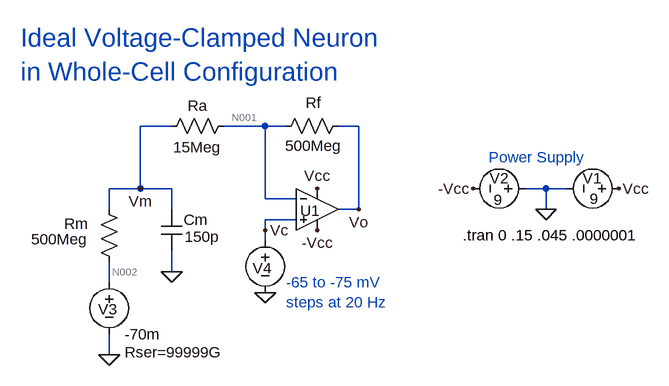
[diagram p0: schematic memtest.asc]
memtest.asc, the LTspice schematic file:
Version 4
SHEET 1 1492 812
WIRE 224 80 176 80
WIRE 368 80 304 80
WIRE 400 80 368 80
WIRE 512 80 480 80
WIRE 176 176 176 80
WIRE 176 176 128 176
WIRE 224 176 176 176
WIRE 800 176 768 176
WIRE 832 176 800 176
WIRE 368 192 368 80
WIRE 416 192 368 192
WIRE 128 208 128 176
WIRE 224 208 224 176
WIRE 512 208 512 80
WIRE 512 208 480 208
WIRE 800 208 800 176
WIRE 416 224 368 224
WIRE 368 240 368 224
WIRE 368 256 368 240
WIRE 224 304 224 272
WIRE 128 320 128 288
WIRE 128 432 128 400
FLAG 912 176 Vcc
FLAG 448 176 Vcc
FLAG 448 240 -Vcc
FLAG 688 176 -Vcc
FLAG 368 336 0
FLAG 224 304 0
FLAG 800 208 0
FLAG 128 432 0
FLAG 368 240 Vc
FLAG 176 176 Vm
FLAG 512 208 Vo
SYMBOL res 496 64 R90
WINDOW 0 -4 54 VBottom 2
WINDOW 3 31 53 VTop 2
SYMATTR InstName Rf
SYMATTR Value 500Meg
SYMBOL voltage 928 176 R90
WINDOW 0 -16 42 VRight 2
WINDOW 3 16 47 VRight 2
WINDOW 123 0 0 Left 0
WINDOW 39 0 0 Left 0
SYMATTR InstName V1
SYMATTR Value 9
SYMBOL OpAmps\\UniversalOpamp2 448 208 R0
WINDOW 0 -26 2 Left 2
SYMATTR InstName U1
SYMBOL voltage 784 176 R90
WINDOW 0 -16 41 VRight 2
WINDOW 3 17 51 VRight 2
WINDOW 123 0 0 Left 0
WINDOW 39 0 0 Left 0
SYMATTR InstName V2
SYMATTR Value 9
SYMBOL voltage 368 240 R0
WINDOW 123 0 0 Left 0
WINDOW 39 0 0 Left 0
WINDOW 0 -19 59 Left 2
WINDOW 3 37 102 Invisible 2
SYMATTR InstName V4
SYMATTR Value PULSE(-75m -65m 0 1f 1f .025 .05 999)
SYMBOL res 320 64 R90
WINDOW 0 0 56 VBottom 2
WINDOW 3 33 56 VTop 2
SYMATTR InstName Ra
SYMATTR Value 15Meg
SYMBOL cap 208 208 R0
WINDOW 0 35 16 Left 2
WINDOW 3 36 42 Left 2
SYMATTR InstName Cm
SYMATTR Value 150p
SYMBOL res 112 192 R0
WINDOW 0 -53 38 Left 2
WINDOW 3 -104 62 Left 2
SYMATTR InstName Rm
SYMATTR Value 500Meg
SYMBOL voltage 128 304 R0
WINDOW 123 0 0 Left 0
WINDOW 39 24 124 Left 2
WINDOW 0 -17 58 Left 2
SYMATTR SpiceLine Rser=99999G
SYMATTR InstName V3
SYMATTR Value -70m
TEXT 400 320 Left 2 ;-65 to -75 mV\nsteps at 20 Hz
TEXT 712 128 Left 2 ;Power Supply
TEXT -8 -56 Left 4 ;Ideal Voltage-Clamped Neuron\nin Whole-Cell Configuration
TEXT 672 248 Left 2 !.tran 0 .15 .045 .0000001

The netlist it stands for:
* memtest.asc
Rf Vo N001 500Meg
V1 Vcc 0 9
XU1 Vc N001 Vcc -Vcc Vo level.2 Avol=1Meg GBW=10Meg Slew=10Meg ilimit=25m rail=0 Vos=0 phimargin=45 en=0 enk=0 in=0 ink=0 Rin=500Meg  ; pins IN+ IN- V+ V- OUT
V2 0 -Vcc 9
V4 Vc 0 PULSE(-75m -65m 0 1f 1f .025 .05 999)
Ra N001 Vm 15Meg
Cm Vm 0 150p
Rm Vm N002 500Meg
V3 N002 0 -70m Rser=99999G
* -65 to -75 mV
* steps at 20 Hz
* Power Supply
* Ideal Voltage-Clamped Neuron
* in Whole-Cell Configuration
.tran 0 .15 .045 .0000001
.lib UniversalOpamps2.sub
.backanno
.end

* Results of the author's LTspice run, read from the files saved beside the schematic
* Operating Point, zero values left out:
*   V(vo) = -150 mV
*   V(n001) = -75 mV
*   V(vcc) = 9 V
*   V(-vcc) = -9 V
*   V(vc) = -75 mV
*   V(vm) = -75 mV
*   V(n002) = -75 mV
*   I(Rf) = -150 pA
*   I(V4) = 150 pA
*   I(V2) = -899.5 µA
*   I(V1) = -899.6 µA
*   Ix(u1:1) = -150 pA
*   Ix(u1:2) = -150 pA
*   Ix(u1:3) = 899.6 µA
*   Ix(u1:4) = -899.5 µA
*   Ix(u1:5) = 150 pA
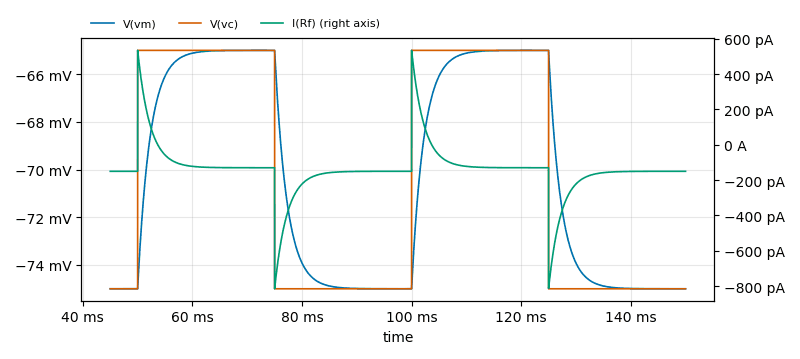
[diagram p1: Transient Analysis of memtest.asc, plotted from the saved traces]
* Transient Analysis, 1 run:
*   V(vm): min -75 mV, max -65 mV, average -70.24 mV, rms 70.38 mV, last -75 mV
*   V(vc): min -75 mV, max -65 mV, average -70.24 mV, rms 70.42 mV, last -75 mV
*   I(Rf): min -815.4 pA, max 534.6 pA, average -140.5 pA, rms 200.1 pA, last -150 pA